# Altium schematic sheet MSP430.SchDoc
size A
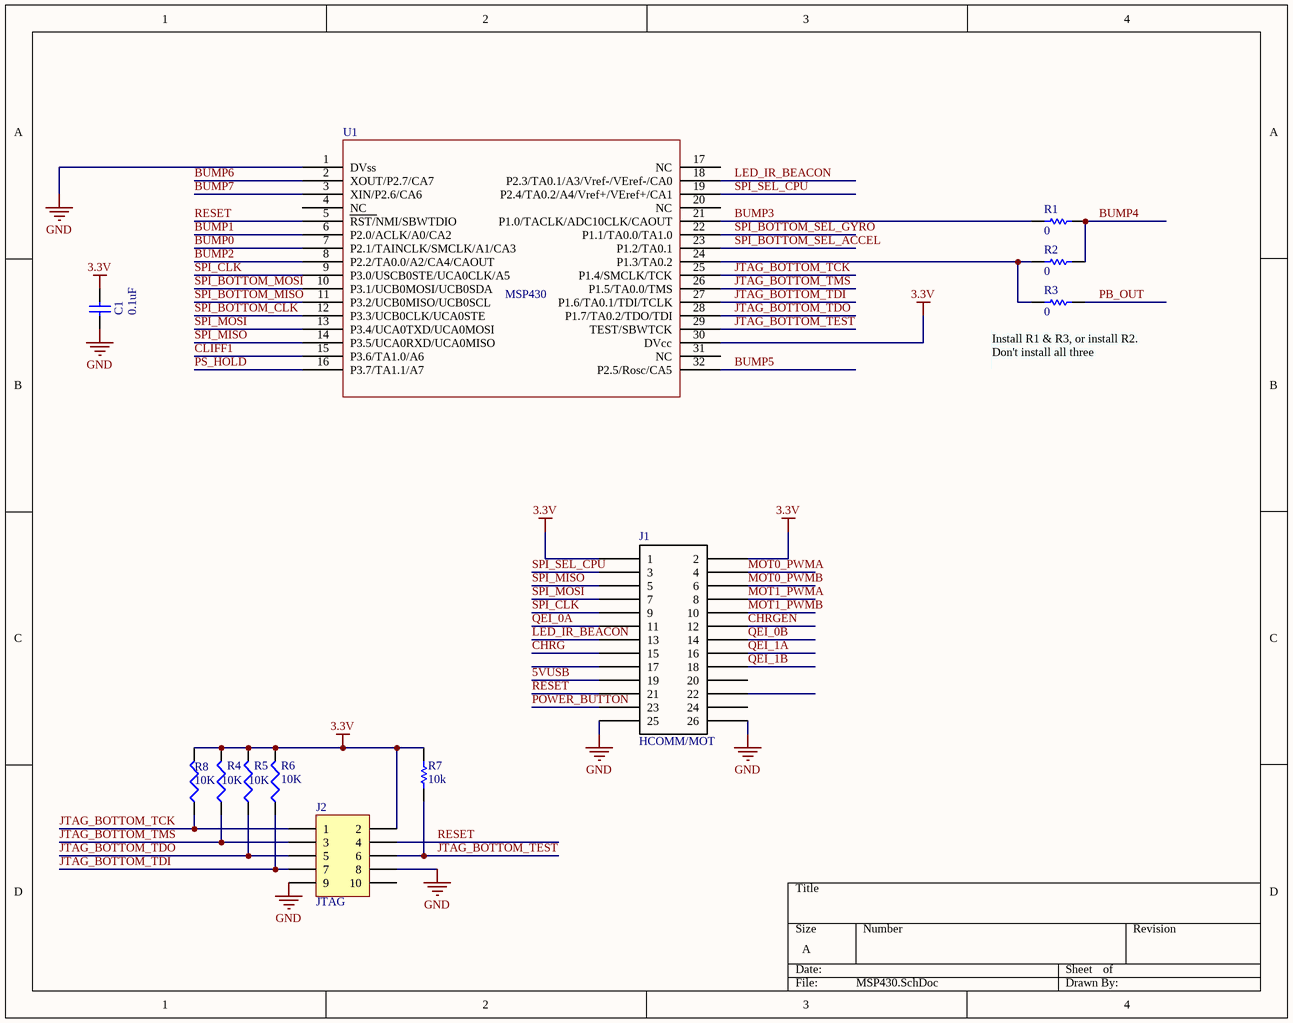
[diagram p0: MSP430.SchDoc]

## Parts
C1  value 0.1uF  [CAPC1005L]  (hidden comment: Cap Semi)
J1  HCOMM/MOT  [HeaderSM 13x2]
J2  JTAG  [HDR2X5]
R1  value 0  [RESC1608L]  (hidden comment: Res Semi)
R2  value 0  [RESC1608L]  (hidden comment: Res Semi)
R3  value 0  [RESC1608L]  (hidden comment: Res Semi)
R4  value 10K  [RESC1608L]  (hidden comment: Res3)
R5  value 10K  [RESC1608L]  (hidden comment: Res3)
R6  value 10K  [RESC1608L]  (hidden comment: Res3)
R7  value 10k  [RESC1608L]  (hidden comment: Res Semi)
R8  value 10K  [RESC1608L]  (hidden comment: Res3)
U1  MSP430  [MSP430_32PIN]

## Nets
3.3V: C1.2 J1.1 J1.2 J2.2 R4.2 R5.2 R6.2 R7.2 R8.2 U1.30(DVcc)
GND: C1.1 J1.25 J1.26 J2.8 J2.9 U1.1(DVss)
5VUSB: J1.19
BUMP0: U1.7(P2.1/TAINCLK/SMCLK/A1/CA3)
BUMP1: U1.6(P2.0/ACLK/A0/CA2)
BUMP2: U1.8(P2.2/TA0.0/A2/CA4/CAOUT)
BUMP3: R1.2 U1.21(P1.0/TACLK/ADC10CLK/CAOUT)
BUMP4: R1.1 R2.1
BUMP5: U1.32(P2.5/Rosc/CA5)
BUMP6: U1.2(XOUT/P2.7/CA7)
BUMP7: U1.3(XIN/P2.6/CA6)
CHRG: J1.15
CHRGEN: J1.12
CLIFF1: U1.15(P3.6/TA1.0/A6)
JTAG_BOTTOM_TCK: J2.1 R8.1 U1.25(P1.4/SMCLK/TCK)
JTAG_BOTTOM_TDI: J2.7 R6.1 U1.27(P1.6/TA0.1/TDI/TCLK)
JTAG_BOTTOM_TDO: J2.5 R5.1 U1.28(P1.7/TA0.2/TDO/TDI)
JTAG_BOTTOM_TEST: J2.6 R7.1 U1.29(TEST/SBWTCK)
JTAG_BOTTOM_TMS: J2.3 R4.1 U1.26(P1.5/TA0.0/TMS)
LED_IR_BEACON: J1.13 U1.18(P2.3/TA0.1/A3/Vref-/VEref-/CA0)
MOT0_PWMA: J1.4
MOT0_PWMB: J1.6
MOT1_PWMA: J1.8
MOT1_PWMB: J1.10
PB_OUT: R3.1
POWER_BUTTON: J1.23
PS_HOLD: U1.16(P3.7/TA1.1/A7)
QEI_0A: J1.11
QEI_0B: J1.14
QEI_1A: J1.16
QEI_1B: J1.18
RESET: J1.21 J2.4 U1.5(RST/NMI/SBWTDIO)
SPI_BOTTOM_CLK: U1.12(P3.3/UCB0CLK/UCA0STE)
SPI_BOTTOM_MISO: U1.11(P3.2/UCB0MISO/UCB0SCL)
SPI_BOTTOM_MOSI: U1.10(P3.1/UCB0MOSI/UCB0SDA)
SPI_BOTTOM_SEL_ACCEL: U1.23(P1.2/TA0.1)
SPI_BOTTOM_SEL_GYRO: U1.22(P1.1/TA0.0/TA1.0)
SPI_CLK: J1.9 U1.9(P3.0/USCB0STE/UCA0CLK/A5)
SPI_MISO: J1.5 U1.14(P3.5/UCA0RXD/UCA0MISO)
SPI_MOSI: J1.7 U1.13(P3.4/UCA0TXD/UCA0MOSI)
SPI_SEL_CPU: J1.3 U1.19(P2.4/TA0.2/A4/Vref+/VEref+/CA1)
NetR2_2: R2.2 R3.2 U1.24(P1.3/TA0.2)

Not connected (* = marked no-connect by the designer): J1 17 20 22 24; J2 10; U1 4(NC) 17(NC) 20(NC) 31(NC)

## Notes on the sheet
- (near R3) Install R1 & R3, or install R2.  Don't install all three

## Library data of the parts
C1 = Cap Semi: Capacitor (Semiconductor SIM Model); Published: 8-Jun-2000; LatestRevisionDate: 29-May-2009; LatestRevisionNote: IPC-7351 Footprint Added.; PackageReference: C1206; Publisher: Altium Limited; PackageDescription: Chip Capacitor
J1 = HCOMM/HMOT: Header, 2X20, 50mil, IDC
J2 = Header 5X2: Header, 5-Pin, Dual row; LatestRevisionDate: 17-Jul-2002; LatestRevisionNote: Re-released for DXP Platform.; Publisher: Altium Limited
R1-R3 R7 = Res Semi: Semiconductor Resistor; Published: 8-Jun-2000; LatestRevisionDate: 17-Jul-2002; LatestRevisionNote: Re-released for DXP Platform.; PackageReference: AXIAL-0.5; Publisher: Altium Limited
R4-R6 R8 = Res3: Resistor; Published: 8-Jun-2000; LatestRevisionDate: 29-May-2009; LatestRevisionNote: IPC-7351 Footprint Added.; PackageReference: J1-0603; Publisher: Altium Limited; PackageDescription: Chip Resistor
U1 = MSP430_32pin